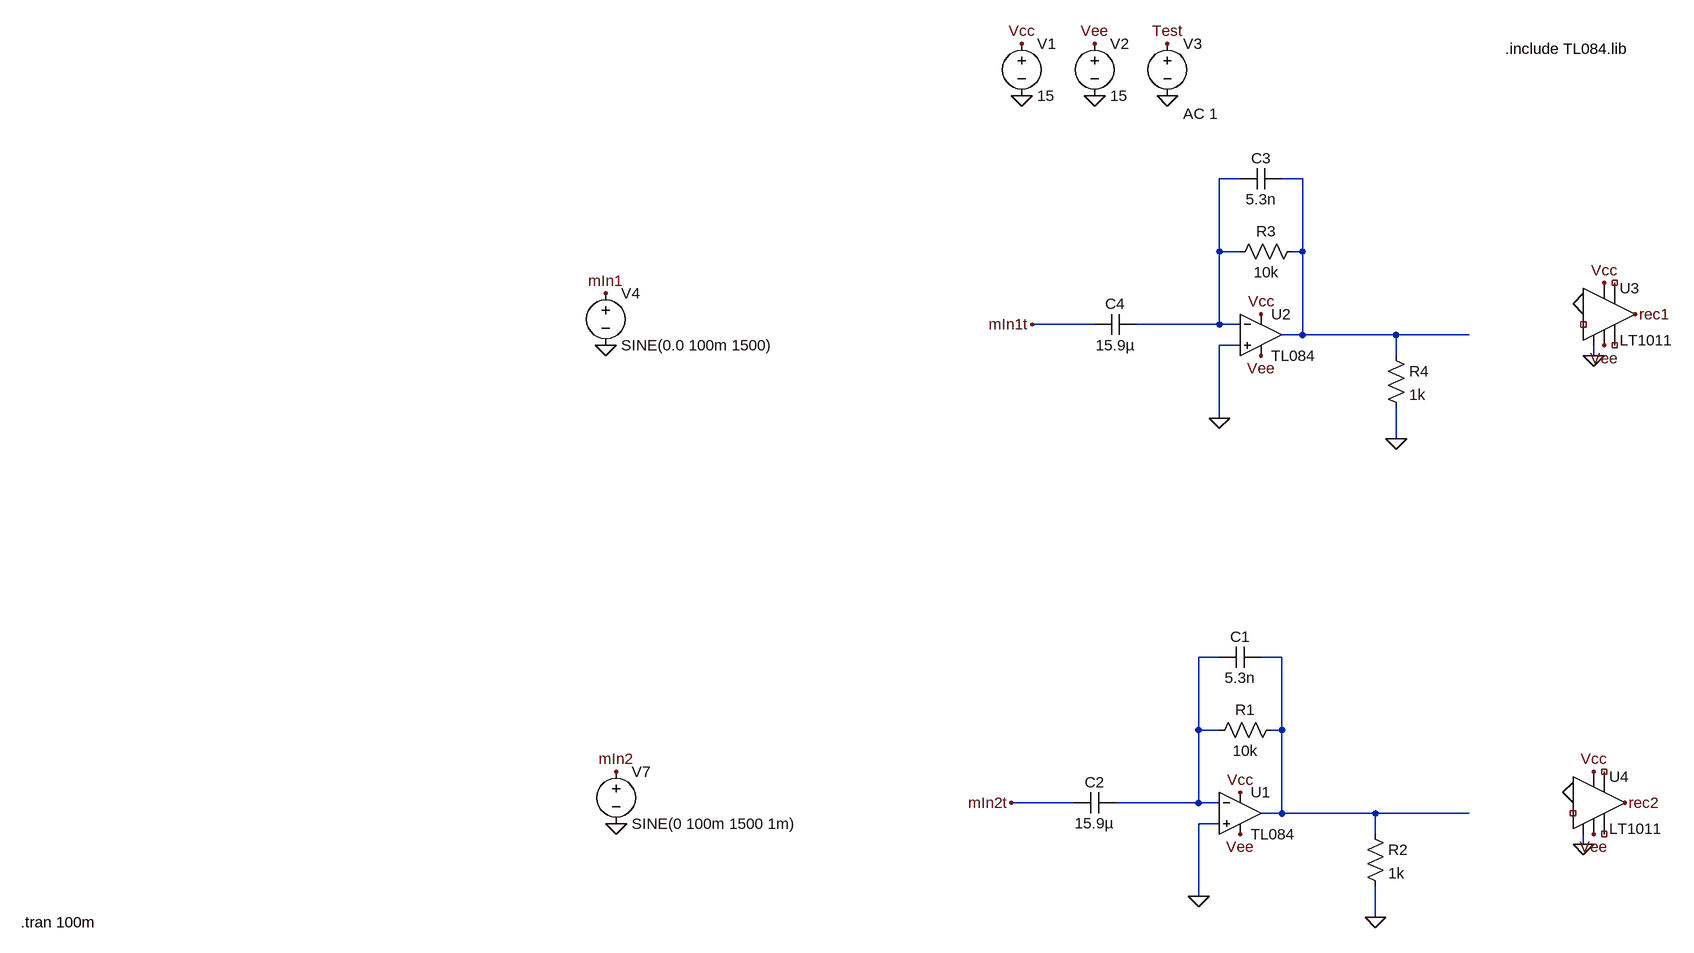
[diagram p0: schematic partsListSchema.asc]
partsListSchema.asc, the LTspice schematic file:
Version 4
SHEET 1 3860 1512
WIRE 320 352 288 352
WIRE 416 352 384 352
WIRE 288 464 288 352
WIRE 320 464 288 464
WIRE 416 464 416 352
WIRE 416 464 400 464
WIRE 96 576 0 576
WIRE 288 576 288 464
WIRE 288 576 160 576
WIRE 320 576 288 576
WIRE 416 592 416 464
WIRE 416 592 384 592
WIRE 560 592 416 592
WIRE 672 592 560 592
WIRE 320 608 288 608
WIRE 560 624 560 592
WIRE 864 624 864 608
WIRE 288 720 288 608
WIRE 560 752 560 704
WIRE 288 1088 256 1088
WIRE 384 1088 352 1088
WIRE 256 1200 256 1088
WIRE 288 1200 256 1200
WIRE 384 1200 384 1088
WIRE 384 1200 368 1200
WIRE 64 1312 -32 1312
WIRE 256 1312 256 1200
WIRE 256 1312 128 1312
WIRE 288 1312 256 1312
WIRE 384 1328 384 1200
WIRE 384 1328 352 1328
WIRE 528 1328 384 1328
WIRE 672 1328 528 1328
WIRE 288 1344 256 1344
WIRE 528 1360 528 1328
WIRE 848 1376 848 1360
WIRE 256 1456 256 1344
WIRE 528 1488 528 1440
FLAG 208 224 0
FLAG 96 224 0
FLAG -16 224 0
FLAG -16 144 Vcc
FLAG 96 144 Vee
FLAG 208 144 Test
FLAG -656 528 mIn1
FLAG -640 1264 mIn2
FLAG -640 1344 0
FLAG -656 608 0
FLAG 256 1456 0
FLAG 528 1488 0
FLAG 288 720 0
FLAG 560 752 0
FLAG 352 560 Vcc
FLAG 320 1296 Vcc
FLAG 352 624 Vee
FLAG 320 1360 Vee
FLAG 848 1376 0
FLAG 864 624 0
FLAG 880 512 Vcc
FLAG 864 1264 Vcc
FLAG 880 608 Vee
FLAG 864 1360 Vee
FLAG 848 544 0
FLAG 832 1296 0
FLAG 0 576 mIn1t
FLAG -32 1312 mIn2t
FLAG 928 560 rec1
FLAG 912 1312 rec2
SYMBOL voltage -16 128 R0
WINDOW 123 0 0 Left 0
WINDOW 39 0 0 Left 0
SYMATTR InstName V1
SYMATTR Value 15
SYMBOL voltage 96 128 R0
WINDOW 123 0 0 Left 0
WINDOW 39 0 0 Left 0
SYMATTR InstName V2
SYMATTR Value 15
SYMBOL voltage 208 128 R0
WINDOW 123 24 124 Left 2
WINDOW 39 0 0 Left 0
SYMATTR Value2 AC 1
SYMATTR InstName V3
SYMATTR Value ""
SYMBOL voltage -656 512 R0
WINDOW 123 0 0 Left 0
WINDOW 39 0 0 Left 0
SYMATTR InstName V4
SYMATTR Value SINE(0.0 100m 1500)
SYMBOL voltage -640 1248 R0
WINDOW 123 0 0 Left 0
WINDOW 39 0 0 Left 0
SYMATTR InstName V7
SYMATTR Value SINE(0 100m 1500 1m)
SYMBOL res 384 1184 R90
WINDOW 0 0 56 VBottom 2
WINDOW 3 32 56 VTop 2
SYMATTR InstName R1
SYMATTR Value 10k
SYMBOL cap 352 1072 R90
WINDOW 0 0 32 VBottom 2
WINDOW 3 32 32 VTop 2
SYMATTR InstName C1
SYMATTR Value 5.3n
SYMBOL cap 128 1296 R90
WINDOW 0 0 32 VBottom 2
WINDOW 3 32 32 VTop 2
SYMATTR InstName C2
SYMATTR Value 15.9µ
SYMBOL Opamps\\opamp2 320 1264 R0
SYMATTR InstName U1
SYMATTR Value TL084
SYMBOL res 512 1344 R0
SYMATTR InstName R2
SYMATTR Value 1k
SYMBOL res 416 448 R90
WINDOW 0 0 56 VBottom 2
WINDOW 3 32 56 VTop 2
SYMATTR InstName R3
SYMATTR Value 10k
SYMBOL cap 384 336 R90
WINDOW 0 0 32 VBottom 2
WINDOW 3 32 32 VTop 2
SYMATTR InstName C3
SYMATTR Value 5.3n
SYMBOL cap 160 560 R90
WINDOW 0 0 32 VBottom 2
WINDOW 3 32 32 VTop 2
SYMATTR InstName C4
SYMATTR Value 15.9µ
SYMBOL Opamps\\opamp2 352 528 R0
SYMATTR InstName U2
SYMATTR Value TL084
SYMBOL res 544 608 R0
SYMATTR InstName R4
SYMATTR Value 1k
SYMBOL Comparators\\LT1011 880 560 R0
SYMATTR InstName U3
SYMBOL Comparators\\LT1011 864 1312 R0
SYMATTR InstName U4
TEXT 728 152 Left 2 !.include TL084.lib
TEXT -1556 1496 Left 2 !.tran 100m

The netlist it stands for:
* partsListSchema.asc
V1 Vcc 0 15
V2 Vee 0 15
V3 Test 0 AC 1
V4 mIn1 0 SINE(0.0 100m 1500)
V7 mIn2 0 SINE(0 100m 1500 1m)
R1 N004 N003 10k
C1 N004 N003 5.3n
C2 N003 mIn2t 15.9µ
XU1 0 N003 Vcc Vee N004 TL084  ; pins In+ In- V+ V- OUT
R2 N004 0 1k
R3 N002 N001 10k
C3 N002 N001 5.3n
C4 N001 mIn1t 15.9µ
XU2 0 N001 Vcc Vee N002 TL084  ; pins In+ In- V+ V- OUT
R4 N002 0 1k
XU3 0 NC_01 0 Vee NC_02 NC_03 rec1 Vcc LT1011
XU4 0 NC_04 0 Vee NC_05 NC_06 rec2 Vcc LT1011
.include TL084.lib
.tran 100m
.lib LTC1.lib
.backanno
.end